# Altium schematic sheet misc.SchDoc
size A
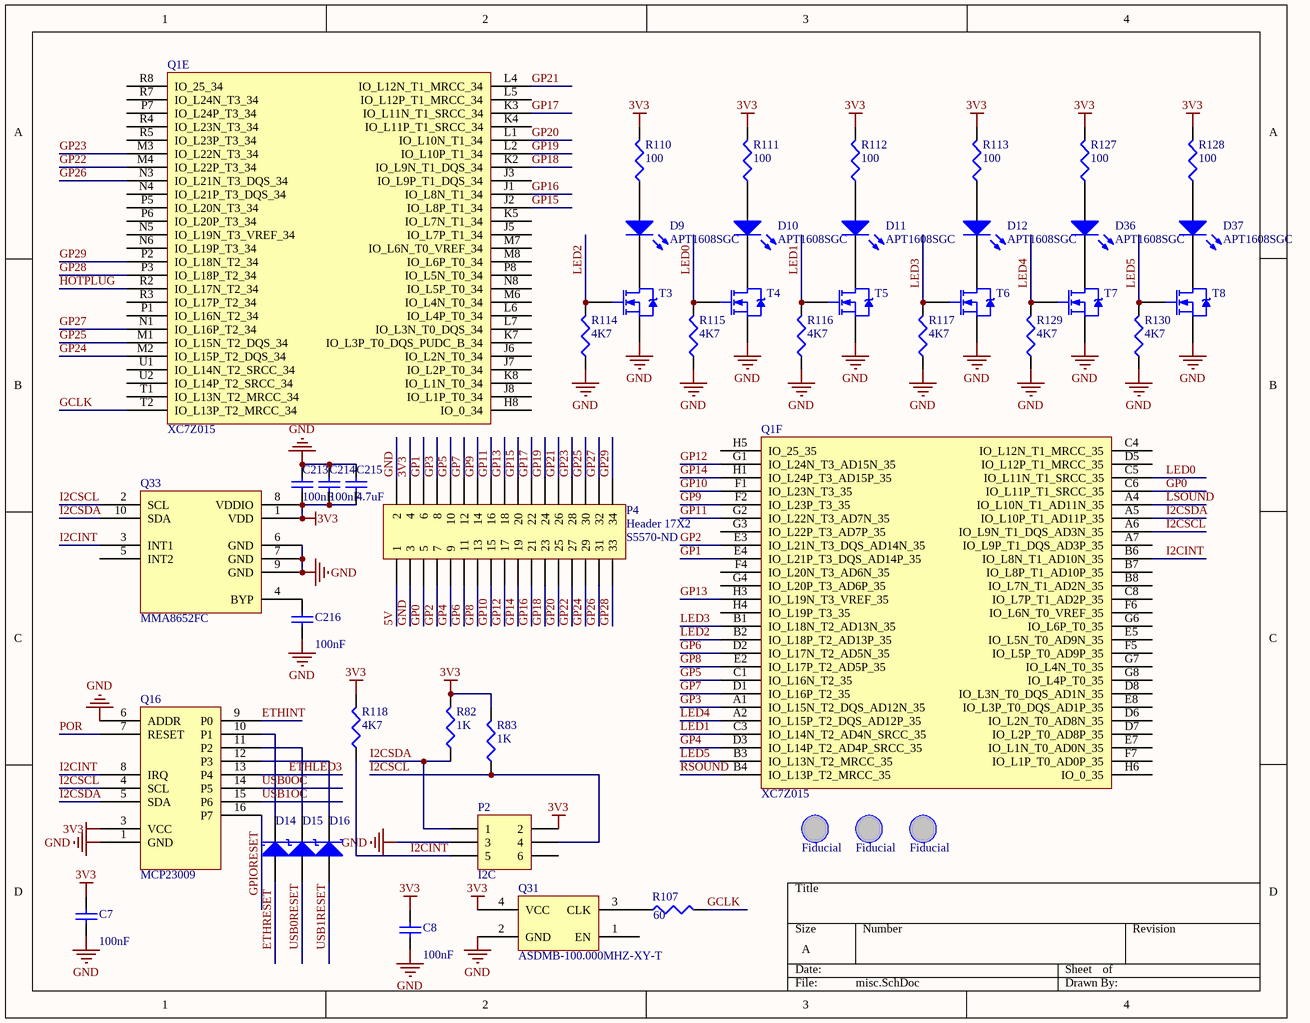
[diagram p0: misc.SchDoc]

## Parts
C7  value 100nF  [CAPC1005X06L]  (hidden comment: Cap)
C8  value 100nF  [CAPC1005X06L]  (hidden comment: Cap)
C213  value 100nF  [CAPC1005X06L]  (hidden comment: Cap)
C214  value 100nF  [CAPC1005X06L]  (hidden comment: Cap)
C215  value 4.7uF  [CAPC1608X90N]  (hidden comment: GRM188R60J475ME19D)
C216  value 100nF  [CAPC1005X06L]  (hidden comment: Cap)
D9  APT1608SGC  [LED-0603]
D10  APT1608SGC  [LED-0603]
D11  APT1608SGC  [LED-0603]
D12  APT1608SGC  [LED-0603]
D14  BAT54FSCT-ND  [BAT54]  (value not drawn)
D15  BAT54FSCT-ND  [BAT54]  (value not drawn)
D16  BAT54FSCT-ND  [BAT54]  (value not drawn)
D36  APT1608SGC  [LED-0603]
D37  APT1608SGC  [LED-0603]
FIDU1  Fiducial  [FIDU]  (no BOM)
FIDU2  Fiducial  [FIDU]  (no BOM)
FIDU3  Fiducial  [FIDU]  (no BOM)
P2  I2C  [HDR2X3]
P4  Header 17X2  Supplier Part Number 1: S5570-ND  [HDR2X17]
Q1  XC7Z015  [BGA484x22]  (parts E,F of 9)
Q16  MCP23009  [MCP23009]
Q31  ASDMB-100.000MHZ-XY-T  [ASDMB]
Q33  MMA8652FC  [MMA8653FC]
R82  value 1K  [J1-0603]  (hidden comment: RC1608J102CS)
R83  value 1K  [J1-0603]  (hidden comment: RC1608J102CS)
R107  value 60  [J1-0603]  (hidden comment: RC1608F60R4CS)
R110  value 100  [J1-0603]  (hidden comment: RC1608F101CS)
R111  value 100  [J1-0603]  (hidden comment: RC1608F101CS)
R112  value 100  [J1-0603]  (hidden comment: RC1608F101CS)
R113  value 100  [J1-0603]  (hidden comment: RC1608F101CS)
R114  value 4K7  [J1-0603]  (hidden comment: RC1608J472CS)
R115  value 4K7  [J1-0603]  (hidden comment: RC1608J472CS)
R116  value 4K7  [J1-0603]  (hidden comment: RC1608J472CS)
R117  value 4K7  [J1-0603]  (hidden comment: RC1608J472CS)
R118  value 4K7  [J1-0603]  (hidden comment: RC1608J472CS)
R127  value 100  [J1-0603]  (hidden comment: RC1608F101CS)
R128  value 100  [J1-0603]  (hidden comment: RC1608F101CS)
R129  value 4K7  [J1-0603]  (hidden comment: RC1608J472CS)
R130  value 4K7  [J1-0603]  (hidden comment: RC1608J472CS)
T3  (no value)  [EMT3F]
T4  (no value)  [EMT3F]
T5  (no value)  [EMT3F]
T6  (no value)  [EMT3F]
T7  (no value)  [EMT3F]
T8  (no value)  [EMT3F]

## Nets
3V3: C7.2 C8.2 C213.2 C214.1 C215.1 P2.2 P4.4 Q16.3(VCC) Q31.4(VCC) Q33.1(VDD) Q33.8(VDDIO) R82.2 R83.2 R110.2 R111.2 R112.2 R113.2 R118.2 R127.2 R128.2
GND: C7.1 C8.1 C213.1 C214.2 C215.2 C216.1 P2.3 P4.2 P4.3 Q16.1(GND) Q16.6(ADDR) Q31.2(GND) Q33.6(GND) Q33.7(GND) Q33.9(GND) R114.1 R115.1 R116.1 R117.1 R129.1 R130.1 T3.2(S) T4.2(S) T5.2(S) T6.2(S) T7.2(S) T8.2(S)
5V: P4.1
ETHINT: Q16.9(P0)
ETHLED3: Q16.13(P4)
ETHRESET: D14.1(A)
GCLK: Q1.T2(IO_L13P_T2_MRCC_34) R107.2
GP0: P4.5 Q1.C6(IO_L11P_T1_SRCC_35)
GP1: P4.6 Q1.E4(IO_L21P_T3_DQS_AD14P_35)
GP2: P4.7 Q1.E3(IO_L21N_T3_DQS_AD14N_35)
GP3: P4.8 Q1.A1(IO_L15N_T2_DQS_AD12N_35)
GP4: P4.9 Q1.D3(IO_L14P_T2_AD4P_SRCC_35)
GP5: P4.10 Q1.C1(IO_L16N_T2_35)
GP6: P4.11 Q1.D2(IO_L17N_T2_AD5N_35)
GP7: P4.12 Q1.D1(IO_L16P_T2_35)
GP8: P4.13 Q1.E2(IO_L17P_T2_AD5P_35)
GP9: P4.14 Q1.F2(IO_L23P_T3_35)
GP10: P4.15 Q1.F1(IO_L23N_T3_35)
GP11: P4.16 Q1.G2(IO_L22N_T3_AD7N_35)
GP12: P4.17 Q1.G1(IO_L24N_T3_AD15N_35)
GP13: P4.18 Q1.H3(IO_L19N_T3_VREF_35)
GP14: P4.19 Q1.H1(IO_L24P_T3_AD15P_35)
GP15: P4.20 Q1.J2(IO_L8P_T1_34)
GP16: P4.21 Q1.J1(IO_L8N_T1_34)
GP17: P4.22 Q1.K3(IO_L11N_T1_SRCC_34)
GP18: P4.23 Q1.K2(IO_L9N_T1_DQS_34)
GP19: P4.24 Q1.L2(IO_L10P_T1_34)
GP20: P4.25 Q1.L1(IO_L10N_T1_34)
GP21: P4.26 Q1.L4(IO_L12N_T1_MRCC_34)
GP22: P4.27 Q1.M4(IO_L22P_T3_34)
GP23: P4.28 Q1.M3(IO_L22N_T3_34)
GP24: P4.29 Q1.M2(IO_L15P_T2_DQS_34)
GP25: P4.30 Q1.M1(IO_L15N_T2_DQS_34)
GP26: P4.31 Q1.N3(IO_L21N_T3_DQS_34)
GP27: P4.32 Q1.N1(IO_L16P_T2_34)
GP28: P4.33 Q1.P3(IO_L18P_T2_34)
GP29: P4.34 Q1.P2(IO_L18N_T2_34)
GPIORESET: Q16.16(P7)
HOTPLUG: Q1.R2(IO_L17N_T2_34)
I2CINT: P2.5 Q1.B6(IO_L8N_T1_AD10N_35) Q16.8(IRQ) Q33.3(INT1) R118.1
I2CSCL: P2.4 Q1.A6(IO_L9N_T1_DQS_AD3N_35) Q16.4(SCL) Q33.2(SCL) R83.1
I2CSDA: P2.1 Q1.A5(IO_L10P_T1_AD11P_35) Q16.5(SDA) Q33.10(SDA) R82.1
LED0: Q1.C5(IO_L11N_T1_SRCC_35) R115.2 T4.1(G)
LED1: Q1.C3(IO_L14N_T2_AD4N_SRCC_35) R116.2 T5.1(G)
LED2: Q1.B2(IO_L18P_T2_AD13P_35) R114.2 T3.1(G)
LED3: Q1.B1(IO_L18N_T2_AD13N_35) R117.2 T6.1(G)
LED4: Q1.A2(IO_L15P_T2_DQS_AD12P_35) R129.2 T7.1(G)
LED5: Q1.B3(IO_L13N_T2_MRCC_35) R130.2 T8.1(G)
LSOUND: Q1.A4(IO_L10N_T1_AD11N_35)
POR: Q16.7(RESET)
RSOUND: Q1.B4(IO_L13P_T2_MRCC_35)
USB0OC: Q16.14(P5)
USB0RESET: D15.1(A)
USB1OC: Q16.15(P6)
USB1RESET: D16.1(A)
NetC216_2: C216.2 Q33.4(BYP)
NetD9_A: D9.A R110.1
NetD9_K: D9.K T3.3(D)
NetD10_A: D10.A R111.1
NetD10_K: D10.K T4.3(D)
NetD11_A: D11.A R112.1
NetD11_K: D11.K T5.3(D)
NetD12_A: D12.A R113.1
NetD12_K: D12.K T6.3(D)
NetD14_2: D14.2(K) Q16.10(P1)
NetD15_2: D15.2(K) Q16.11(P2)
NetD16_2: D16.2(K) Q16.12(P3)
NetD36_A: D36.A R127.1
NetD36_K: D36.K T7.3(D)
NetD37_A: D37.A R128.1
NetD37_K: D37.K T8.3(D)
NetQ31_3: Q31.3(CLK) R107.1

Not connected (* = marked no-connect by the designer): P2 6; Q1 A7(IO_L9P_T1_DQS_AD3P_35) B7(IO_L8P_T1_AD10P_35) B8(IO_L7N_T1_AD2N_35) C4(IO_L12N_T1_MRCC_35) C8(IO_L7P_T1_AD2P_35) D5(IO_L12P_T1_MRCC_35) D6(IO_L2N_T0_AD8N_35) D7(IO_L2P_T0_AD8P_35) D8(IO_L3N_T0_DQS_AD1N_35) E5(IO_L5N_T0_AD9N_35) E7(IO_L1N_T0_AD0N_35) E8(IO_L3P_T0_DQS_AD1P_35) F4(IO_L20N_T3_AD6N_35) F5(IO_L5P_T0_AD9P_35) F6(IO_L6N_T0_VREF_35) F7(IO_L1P_T0_AD0P_35) G3(IO_L22P_T3_AD7P_35) G4(IO_L20P_T3_AD6P_35) G6(IO_L6P_T0_35) G7(IO_L4N_T0_35) G8(IO_L4P_T0_35) H4(IO_L19P_T3_35) H5(IO_25_35) H6(IO_0_35) H8(IO_0_34) J3(IO_L9P_T1_DQS_34) J5(IO_L7P_T1_34) J6(IO_L2N_T0_34) J7(IO_L2P_T0_34) J8(IO_L1P_T0_34) K4(IO_L11P_T1_SRCC_34) K5(IO_L7N_T1_34) K7(IO_L3P_T0_DQS_PUDC_B_34) K8(IO_L1N_T0_34) L5(IO_L12P_T1_MRCC_34) L6(IO_L4P_T0_34) L7(IO_L3N_T0_DQS_34) M6(IO_L4N_T0_34) M7(IO_L6N_T0_VREF_34) M8(IO_L6P_T0_34) N4(IO_L21P_T3_DQS_34) N5(IO_L19N_T3_VREF_34) N6(IO_L19P_T3_34) N8(IO_L5P_T0_34) P1(IO_L16N_T2_34) P5(IO_L20N_T3_34) P6(IO_L20P_T3_34) P7(IO_L24P_T3_34) P8(IO_L5N_T0_34) R3(IO_L17P_T2_34) R4(IO_L23N_T3_34) R5(IO_L23P_T3_34) R7(IO_L24N_T3_34) R8(IO_25_34) T1(IO_L13N_T2_MRCC_34) U1(IO_L14N_T2_SRCC_34) U2(IO_L14P_T2_SRCC_34); Q31 1(EN); Q33 5(INT2)

## Library data of the parts
C7 C8 C213-C216 = Cap: Capacitor; Published: 8-Jun-2000; LatestRevisionDate: 17-Jul-2002; LatestRevisionNote: Re-released for DXP Platform.; PackageReference: RAD-0.3; Publisher: Altium Limited; PackageDescription: Radial Cap, Thru-Hole; 2 Leads; 0.3 in Pin Spacing; Supplier 1: Digi-Key
  C7 C8 C213 C214 C216: Supplier Part Number 1: 1276-1443-1-ND
  C215: Supplier Part Number 1: 490-5421-1-ND
D9-D12 D36 D37 = LED2: Typical RED, GREEN, YELLOW, AMBER GaAs LED; Published: 8-Jun-2000; LatestRevisionDate: 17-Jul-2002; LatestRevisionNote: Re-released for DXP Platform.; PackageVersion: Feb-2002; PackageReference: 3.2X1.6X1.1; Publisher: Altium Limited; PackageDescription: SM LED; 2 Flat Leads; Supplier 1: Digi-Key; Supplier Part Number 1: 754-1121-1-ND
D14-D16 = D Schottky: Schottky Diode; Published: 8-Jun-2000; LatestRevisionDate: 17-Jul-2002; LatestRevisionNote: Re-released for DXP Platform.; PackageReference: SMB; Publisher: Altium Limited; PackageDescription: DO-214-AA/SMB; 2 C-Bend Leads; Body 5.3 x 3.6 mm, inc. leads (LxW); Code_JEDEC: DO-214-AA; Supplier 1: Digi-Key; Supplier Part Number 1: BAT54FSCT-ND
FIDU1-FIDU3 = FIDU
P2 = Header 3X2: Header, 3-Pin, Dual row; LatestRevisionDate: 17-Jul-2002; LatestRevisionNote: Re-released for DXP Platform.; Publisher: Altium Limited
P4 = Header 17X2: Header, 17-Pin, Dual row; LatestRevisionDate: 17-Jul-2002; LatestRevisionNote: Re-released for DXP Platform.; Publisher: Altium Limited; Supplier 1: Digi-Key
Q31 = osc: Supplier 1: Digi-Key; Supplier Part Number 1: 535-11147-1-ND
R82 R83 R107 R110-R118 R127-R130 = Res3: Resistor; Published: 8-Jun-2000; LatestRevisionDate: 29-May-2009; LatestRevisionNote: IPC-7351 Footprint Added.; PackageReference: J1-0603; PackageDescription: Chip Resistor; Supplier 1: Digi-Key
  R82 R83: Publisher: Altium Limited; Supplier Part Number 1: 1276-5062-1-ND
  R107: Supplier Part Number 1: 1276-4547-1-ND
  R110-R113 R127 R128: Supplier Part Number 1: 1276-3482-1-ND
  R114-R118 R129 R130: Supplier Part Number 1: 1276-5078-1-ND
T3-T8 = NMOS-2: N-Channel Power MOSFET; Note: Pin 2 is electrically connected to pin 4.; Published: 8-Jun-2000; LatestRevisionDate: 17-Jul-2002; LatestRevisionNote: Re-released for DXP Platform.; DatasheetVersion: PD-9.814; PackageVersion: Feb-1997; PackageReference: TO-220AB; Publisher: Altium Limited; PackageDescription: TO, Thru-Hole, Vertical, Heatsink Mounted; 3 In-Line Leads; Pitch 2.54 mm; ComponentLink1Description: Manufacturer Link; ComponentLink1URL: http://www.irf.com/; Supplier 1: Digi-Key; Supplier Part Number 1: RE1C002UNTCLDKR-ND
Q1 = XC7Z015: Supplier 1: Digi-Key; Supplier Part Number 1: 122-1905-ND
Q16 = MCP23009: Supplier 1: Digi-Key; Supplier Part Number 1: MCP23009-E/MG-ND
Q33 = MMA8652FC: Supplier 1: Digi-Key; Supplier Part Number 1: MMA8652FCR1CT-ND